# Altium schematic sheet Peripherals.SchDoc
size A
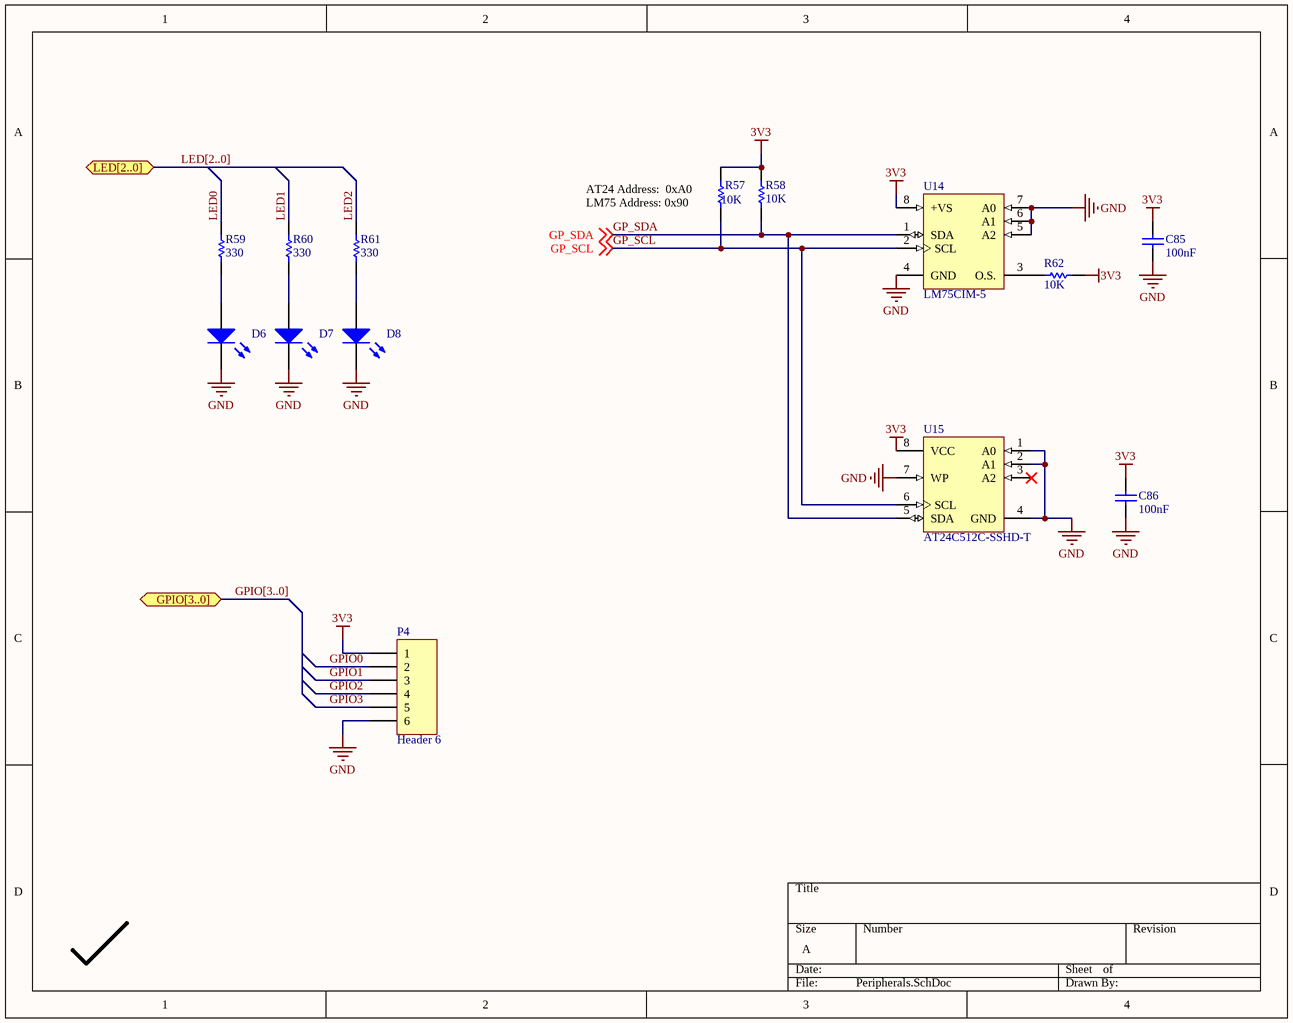
[diagram p0: Peripherals.SchDoc]

## Parts
C85  value 100nF  [0603PKG]  (hidden comment: Cap)
C86  value 100nF  [0603PKG]  (hidden comment: Cap)
D6  LED0  [C0805]  (value not drawn)
D7  LED0  [C0805]  (value not drawn)
D8  LED0  [C0805]  (value not drawn)
P4  Header 6  [HDR1X6]
R57  value 10K  [0603PKG]  (hidden comment: Res Semi)
R58  value 10K  [0603PKG]  (hidden comment: Res Semi)
R59  value 330  [0603PKG]  (hidden comment: Res Semi)
R60  value 330  [0603PKG]  (hidden comment: Res Semi)
R61  value 330  [0603PKG]  (hidden comment: Res Semi)
R62  value 10K  [0603PKG]  (hidden comment: Res Semi)
U14  LM75CIM-5  [8S1_N]
U15  AT24C512C-SSHD-T  [8S1_N]

## Ports
GPIO[3..0], LED[2..0]

## Nets
3V3: C85.2 C86.2 P4.1 R57.1 R58.1 R62.1 U14.8(+VS) U15.8(VCC)
GND: C85.1 C86.1 D6.2(K) D7.2(K) D8.2(K) P4.6 U14.4(GND) U14.5(A2) U14.6(A1) U14.7(A0) U15.1(A0) U15.2(A1) U15.4(GND) U15.7(WP)
GP_SCL: R57.2 U14.2(SCL) U15.6(SCL) ; off-sheet GP_SCL
GP_SDA: R58.2 U14.1(SDA) U15.5(SDA) ; off-sheet GP_SDA
GPIO0: P4.2
GPIO1: P4.3
GPIO2: P4.4
GPIO3: P4.5
LED0: R59.2
LED1: R60.2
LED2: R61.2
NetD6_1: D6.1(A) R59.1
NetD7_1: D7.1(A) R60.1
NetD8_1: D8.1(A) R61.1
NetR62_2: R62.2 U14.3(O.S.)

Not connected (* = marked no-connect by the designer): U15 3(A2)*

## Buses and harness runs
bus GPIO[3..0] = port GPIO[3..0]
bus LED[2..0] = port LED[2..0]

## Notes on the sheet
- (near R57) AT24 Address:  0xA0
  LM75 Address: 0x90

## Library data of the parts
C85 C86 = Cap: Capacitor; Published: 8-Jun-2000; LatestRevisionDate: 17-Jul-2002; LatestRevisionNote: Re-released for DXP Platform.; PackageReference: RAD-0.3; Publisher: Altium Limited; PackageDescription: Radial Cap, Thru-Hole; 2 Leads; 0.3 in Pin Spacing
D6-D8 = LED0: Typical INFRARED GaAs LED; Published: 8-Jun-2000; LatestRevisionDate: 08-Jul-2005; LatestRevisionNote: Mech Layer 1 removed.; PackageReference: LED-0; Publisher: Altium Limited; PackageDescription: LED; 2 Leads
P4 = Header 6: Header, 6-Pin; LatestRevisionDate: 17-Jul-2002; LatestRevisionNote: Re-released for DXP Platform.; Publisher: Altium Limited
R57-R62 = Res Semi: Semiconductor Resistor; Published: 8-Jun-2000; LatestRevisionDate: 17-Jul-2002; LatestRevisionNote: Re-released for DXP Platform.; PackageReference: AXIAL-0.5; Publisher: Altium Limited; PackageDescription: Axial Device, Thru-Hole; 2 Leads; 0.5 in Pin Spacing
U14 = LM75CIMMX-5/NOPB: Digital Temperature Sensor and Thermal Watchdog with Two-Wire Interface, 8 pin MINI SOIC; Manufacturer: National Semiconductor; PackageTopMarking: ZXTT*T00C; PowerWise: N; CompType: Temp Sensor IC; High-Reliability: Y; DatasheetVersion: Jul-2009; PackageVersion: revF, Apr-2008; PackageReference: MUA08A; PackageDescription: MINI SOIC, .118 x .118 x .034in, 8 Lead, .0256in Pitch; PartNumber: LM75CIMMX-5/NOPB; RoHS: Y; PinCount: 8; Code_JEDEC: MO-187-AA; ComponentLink1Description: Manufacturer URL; ComponentLink1URL: http://www.national.com/; ComponentLink2Description: LM75C Datasheet; ComponentLink2URL: http://www.national.com/ds/LM/LM75C.pdf; ComponentLink3Description: LM75C Web Page; ComponentLink3URL: http://www.national.com/pf/LM/LM75C.html; ComponentLink4Description: MUA08A Package Page; ComponentLink4URL: http://www.national.com/packaging/folders/mua08a.html
U15 = AT24C01BN-SP25-B: 1Kbit (128 x 8), 2-wire Bus Automotive Serial EEPROM with Write Protect, 2.5V, 8-Pin SOIC, Bulk; DatasheetVersion: 8517C,  Jan-2009; PackageVersion: revC, Mar-2005; PackageReference: 8S1; PackageDescription: 8-Lead (0.150" Wide Body), Plastic Gull Wing Small Outline (JEDEC SOIC); Code_JEDEC: MS-012-AA; Code_IPC: SOIC127P600-8; ComponentLink1Description: Manufacturer URL; ComponentLink1URL: http://www.atmel.com/; ComponentLink2Description: Datasheet; ComponentLink2URL: http://www.atmel.com/dyn/resources/prod_documents/doc8517.pdf